# Altium schematic sheet Seed Laser Controller.SchDoc
size 267 x 211 mm
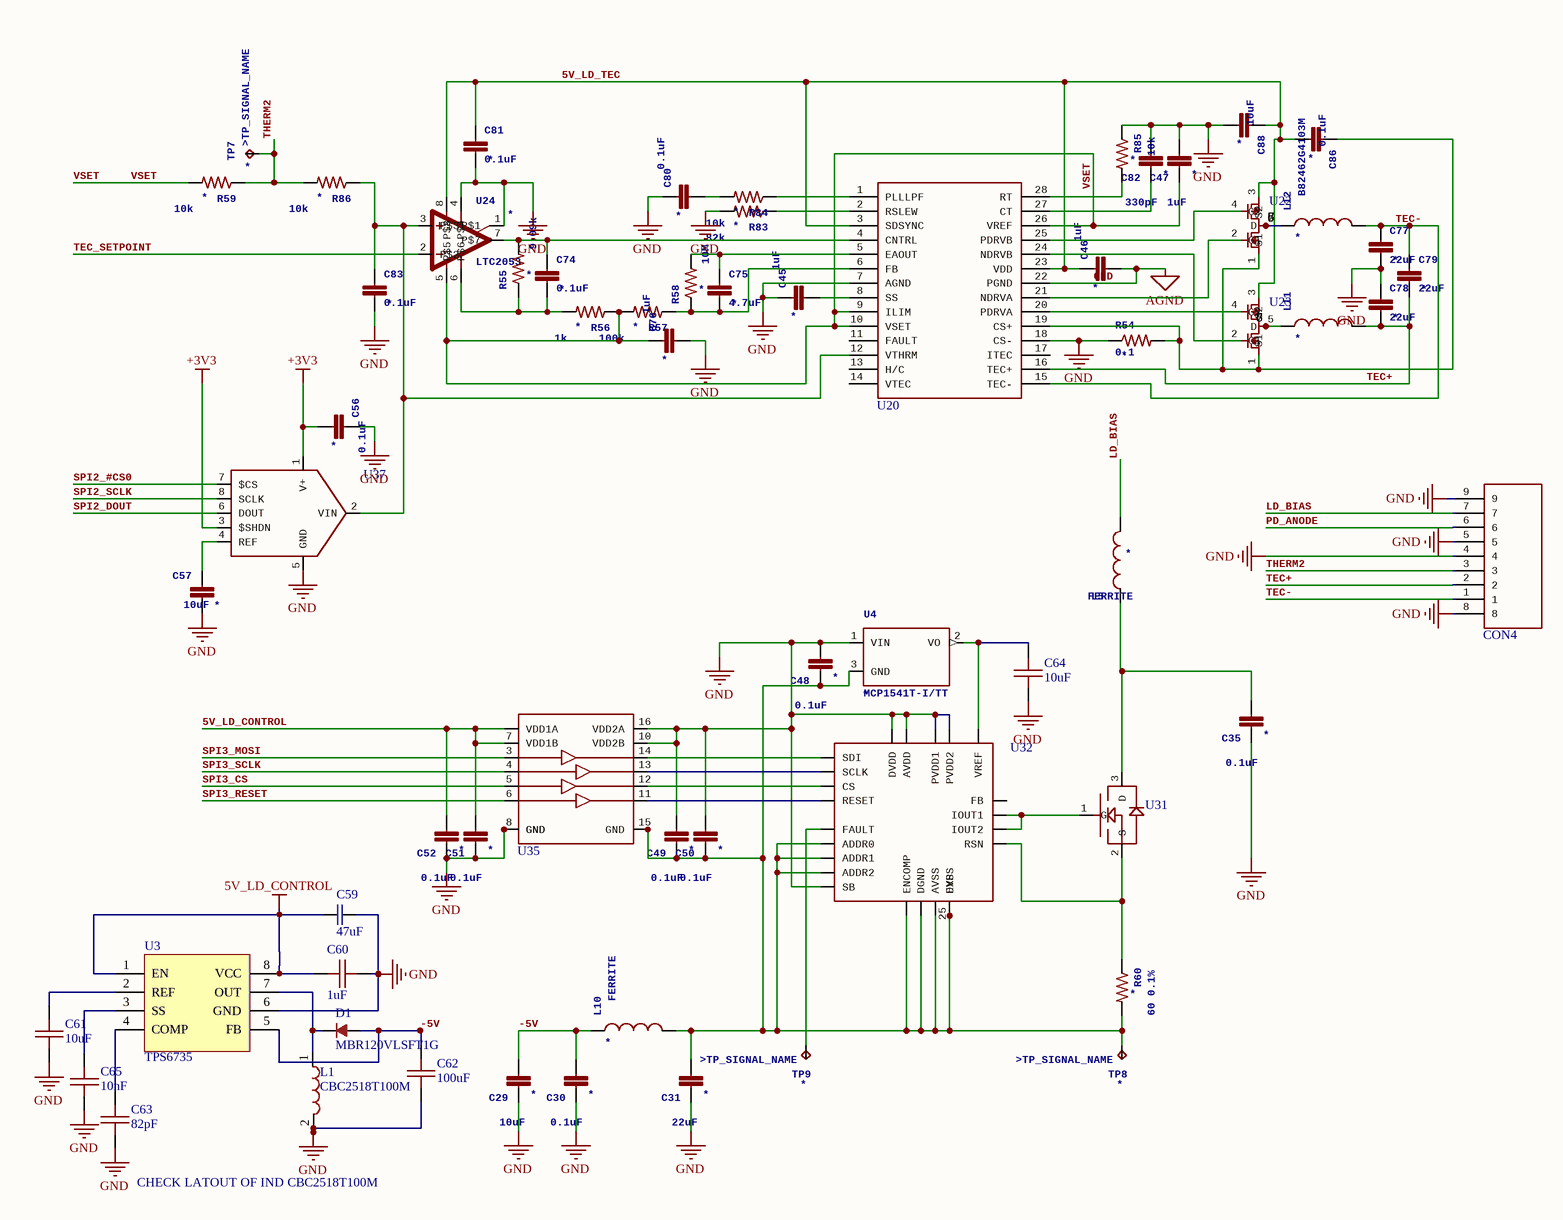
[diagram p0: Seed Laser Controller.SchDoc]

## Parts
C29  10uF  [0603]
C30  0.1uF  [0603]
C31  22uF  [0603]
C35  0.1uF  [0603]
C45  1uF  [0402]
C46  1uF  [0402]
C47  1uF  [0402]
C48  0.1uF  [0402 B]
C49  0.1uF  [0402 B]
C50  0.1uF  [0402 B]
C51  0.1uF  [0402 B]
C52  0.1uF  [0402 B]
C56  0.1uF  [0402]
C57  10uF  [0603]
C59  47uF  [0603]
C60  1uF  [0402 B]
C61  10uF  [0402 B]
C62  100uF  [1206 B]
C63  82pF  [0402 B]
C64  10uF  [0402 B]
C65  10nF  [0402 B]
C74  0.1uF  [0603]
C75  4.7uF  [0603]
C76  1uF  [0402]
C77  22uF  [0402]
C78  22uF  [0402]
C79  22uF  [0603]
C80  0.1uF  [0402]
C81  0.1uF  [0603]
C82  330pF  [0402]
C83  0.1uF  [0402]
C86  0.1uF  [0402]
C88  10uF  [0603]
CON4  SAMTEC_T1M_X7  [T1M-07-F-SH-L-K]  (value not drawn)
D1  MBR120VLSFT1G  [SOD123FL]
L1  CBC2518T100M  [1007]
L5  FERRITE  [0603R]
L10  FERRITE  [0603R]
L11  B82462G4103M  [B82462G]  (value not drawn)
L12  B82462G4103M  [B82462G]
R54  0.1  [1206R]
R55  9.09k  [0603R]
R56  1k  [0603R]
R57  100k  [0603R]
R58  10M  [0603R]
R59  10k  [0603R]
R60  60 0.1%  [0603R]
R83  82k  [0402R]
R84  10k  [0402R]
R85  10k  [0402R]
R86  10k  [0603R]
TP7  TP_SIGNAL_NAME: >TP_SIGNAL_NAME  [B1,27]  (hidden comment: TPB1,27)
TP8  TP_SIGNAL_NAME: >TP_SIGNAL_NAME  [B1,27]  (hidden comment: TPB1,27)
TP9  TP_SIGNAL_NAME: >TP_SIGNAL_NAME  [B1,27]  (hidden comment: TPB1,27)
U3  TPS6735  [SOIC8]
U4  MCP1541T-I/TT  [SOT-23]
U20  LTC1923SSOP28  [SSOP-28]  (value not drawn)
U22  SI9801DY  [SOIC8]  (value not drawn)
U23  SI9801DY  [SOIC8]  (value not drawn)
U24  LTC2053  [MSOP8]
U31  SI2334DS  [SOT-23]  (value not drawn)
U32  ADN8810ACPZ  [LFCSP-24]  (value not drawn)
U35  ADUM7440  [QSOP16]  (value not drawn)
U37  MAX1240  [SOIC8]  (value not drawn)

## Nets
5V_LD_CONTROL: C51.2 C52.2 C59.1 C60.2 U3.1(EN) U3.8(VCC) U35.1(VDD1A) U35.7(VDD1B)
+3V3: C56.2 U37.1(V+) U37.3($SHDN)
GND: C29.1 C30.1 C31.1 C35.1 C45.1 C46.2 C47.2 C48.2 C49.2 C50.2 C51.1 C52.1 C56.1 C57.2 C59.2 C60.1 C61.1 C62.1 C63.1 C64.1 C65.1 C76.2 C77.2 C78.1 C80.1 C81.2 C82.2 C83.2 C88.2 CON4.4 CON4.5 CON4.8 CON4.9 L1.2 R54.1 R83.2 R85.1 U3.6(GND) U4.1(VIN) U20.7(AGND) U20.18(CS-) U20.22(PGND) U24.1(P$1) U24.4(P$4) U32.7(SB) U32.8(PVDD1) U32.11(PVDD2) U32.15(AVDD) U32.23(DVDD) U35.2(GND) U35.8(GND) U35.10(VDD2B) U35.16(VDD2A) U37.5(GND)  [also labelled AGND]
5V_LD_TEC: C46.1 C81.1 C86.2 C88.1 U20.3(SDSYNC) U20.23(VDD) U22.3(S2) U23.3(S2) U24.8(P$8)
-5V: C29.2 C30.2 C62.2 D1.2(A) L10.1 U3.5(FB)
LD_BIAS: CON4.7 L5.2
PD_ANODE: CON4.6
SPI2_#CS0: U37.7($CS)
SPI2_DOUT: U37.6(DOUT)
SPI2_SCLK: U37.8(SCLK)
SPI3_CS: U35.5(P$5)
SPI3_MOSI: U35.3(P$3)
SPI3_RESET: U35.6(P$6)
SPI3_SCLK: U35.4(P$4)
TEC+: C78.2 C79.2 CON4.2 L11.P$2 U20.16(TEC+)
TEC-: C77.1 C79.1 CON4.1 L12.P$2 U20.15(TEC-)
TEC_SETPOINT: U24.2(P$2)
THERM2: CON4.3 R59.1 R86.2 TP7.TP
VSET: C47.1 C76.1 R56.1 R57.2 R59.2 U20.9(ILIM) U20.10(VSET) U20.26(VREF) U24.5(P$5)
NetC31_2: C31.2 C48.1 C49.1 C50.1 L10.2 R60.2 TP8.TP U4.3(GND) U32.1(ADDR2) U32.4(ADDR1) U32.5(ADDR0) U32.12(ENCOMP) U32.16(AVSS) U32.18(DVSS) U32.24(DGND) U32.25(EXP) U35.9(GND) U35.15(GND)
NetC35_2: C35.2 L5.1 U31.3(D)
NetC45_2: C45.2 U20.8(SS)
NetC57_1: C57.1 U37.4(REF)
NetC61_2: C61.2 U3.2(REF)
NetC63_2: C63.2 U3.4(COMP)
NetC64_2: C64.2 U4.2(VO) U32.14(VREF)
NetC65_2: C65.2 U3.3(SS)
NetC74_1: C74.1 R55.2 U20.4(CNTRL) U24.7(P$7)
NetC74_2: C74.2 R55.1 R56.2 U24.6(P$6)
NetC75_1: C75.1 R58.2 U20.5(EAOUT)
NetC75_2: C75.2 R57.1 R58.1 U20.6(FB)
NetC80_2: C80.2 R84.2
NetC82_1: C82.1 U20.27(CT)
NetC83_1: C83.1 R86.1 U20.12(VTHRM) U24.3(P$3) U37.2(VIN)
NetC86_1: C86.1 R54.2 U20.19(CS+) U22.1(S1) U23.1(S1)
NetD1_1: D1.1(K) L1.1 U3.7(OUT)
NetL11_P$1: L11.P$1 U23.5(D) U23.6(D) U23.7(D) U23.8(D)
NetL12_P$1: L12.P$1 U22.5(D) U22.6(D) U22.7(D) U22.8(D)
NetR60_1: R60.1 U31.2(S) U32.2(RSN)
NetR83_1: R83.1 U20.2(RSLEW)
NetR84_1: R84.1 U20.1(PLLLPF)
NetR85_2: R85.2 U20.28(RT)
NetTP9_TP: TP9.TP U32.6(FAULT)
NetU20_20: U20.20(PDRVA) U23.4(G2)
NetU20_21: U20.21(NDRVA) U22.2(G1)
NetU20_24: U20.24(NDRVB) U23.2(G1)
NetU20_25: U20.25(PDRVB) U22.4(G2)
NetU31_1: U31.1(G) U32.9(IOUT1) U32.10(IOUT2)
NetU32_19: U32.19(SDI) U35.14(P$14)
NetU32_20: U32.20(SCLK) U35.13(P$13)
NetU32_21: U32.21(CS) U35.12(P$12)
NetU32_22: U32.22(RESET) U35.11(P$11)

Not connected (* = marked no-connect by the designer): U20 11(FAULT) 13(H/C) 14(VTEC) 17(ITEC); U32 3(FB)

## Notes on the sheet
- CHECK LATOUT OF IND CBC2518T100M

## Library data of the parts
C29-C31 C35 C57 C88 = C-EUC0603K: CAPACITOR, European symbol; GateName_1: G$1; SymbolName_1: C-EU; DeviceName: C0603K; LibraryName: rcl; DeviceSetName: C-EU; NAME: *
C45-C52 C76-C78 C80-C83 C86 = C-EUC0402: CAPACITOR, European symbol; GateName_1: G$1; SymbolName_1: C-EU; DeviceName: C0402; LibraryName: rcl; DeviceSetName: C-EU; NAME: *
C56 = C-EUC0402K: CAPACITOR, European symbol; GateName_1: G$1; SymbolName_1: C-EU; DeviceName: C0402K; LibraryName: rcl; DeviceSetName: C-EU; NAME: *
C59 = Cap 0603
C60 C61 C63-C65 = CAP 0402: 402 Capacitor
C62 = CAP 1206: 1206 Capacitor
C74 C75 C79 = C-EUC0603: CAPACITOR, European symbol; GateName_1: G$1; SymbolName_1: C-EU; DeviceName: C0603; LibraryName: rcl; DeviceSetName: C-EU; NAME: *
CON4 = SAMTEC_T1M_X7: GateName_1: G$1; SymbolName_1: SAMTEC_T1M_X7; LibraryName: custom; DeviceSetName: SAMTEC_T1M_X7
D1 = MBR120VLSFT1G: DIODE SCHOTTKY 20V 1A
L5 L10 = INDUCTOR0603: InductorsBasic Inductor/Choke - 0603 and 1206. Footprints are not proven and vary greatly between part numbers.SRN6045- 33uH, 20% 1.4ASDR0403-560KL - 56uH, 10%, 500mA RMS/740mA peak; GateName_1: G$1; DeviceName: 0603; SymbolName_1: INDUCTOR; LibraryName: SparkFun-Passives; DeviceSetName: INDUCTOR; NAME: *
L11 L12 = INDUCTOR-B82462G: 10uH; GateName_1: G$1; SymbolName_1: INDUCTOR; DeviceName: -B82462G; LibraryName: SparkFun-Passives; DeviceSetName: INDUCTOR; NAME: *
R54 = R-US_R1206: RESISTOR, American symbol; GateName_1: G$1; SymbolName_1: R-US; DeviceName: R1206; DeviceSetName: R-US_; LibraryName: rcl; NAME: *
R55-R60 R86 = R-US_R0603: RESISTOR, American symbol; GateName_1: G$1; SymbolName_1: R-US; DeviceName: R0603; DeviceSetName: R-US_; LibraryName: rcl; NAME: *
R83-R85 = R-US_R0402: RESISTOR, American symbol; GateName_1: G$1; SymbolName_1: R-US; DeviceName: R0402; DeviceSetName: R-US_; LibraryName: rcl; NAME: *
TP7-TP9 = TPB1,27: Test pad; GateName_1: G$1; SymbolName_1: TP; DeviceName: B1,27; LibraryName: testpad; DeviceSetName: TP; NAME: *
U4 = MC15*TT: 2.5V and 4.096V Voltage ReferencesSource: http://www.microchip.com .. 21653b.pdf; GateName_1: G$1; SymbolName_1: MCP1525; DeviceName: TT; DeviceSetName: MC15*; LibraryName: microchip; MF: *; MPN: *; NAME: *; OC_FARNELL: unknown; OC_NEWARK: unknown
U20 = LTC1923SSOP28: GateName_1: G$1; DeviceName: SSOP28; SymbolName_1: LTC1923; LibraryName: custom; DeviceSetName: LTC1923
U22 U23 = SI9801DY: GateName_1: G$1; SymbolName_1: SI9801DY; LibraryName: custom; DeviceSetName: SI9801DY
U24 = LTC2053: GateName_1: G$1; SymbolName_1: LTC2053; LibraryName: custom; DeviceSetName: LTC2053; NAME: *
U31 = SI2334DS: GateName_1: G$1; SymbolName_1: N-CHANNEL; LibraryName: custom; DeviceSetName: SI2334DS
U32 = ADN8810: GateName_1: G$1; SymbolName_1: ADN8810; LibraryName: custom; DeviceSetName: ADN8810
U35 = ADUM7440: GateName_1: G$1; SymbolName_1: ADUM7440; LibraryName: custom; DeviceSetName: ADUM7440
U37 = MAX1240: GateName_1: G$1; SymbolName_1: MAX1240; LibraryName: custom; DeviceSetName: MAX1240